# Altium schematic sheet LAN.SchDoc
size B
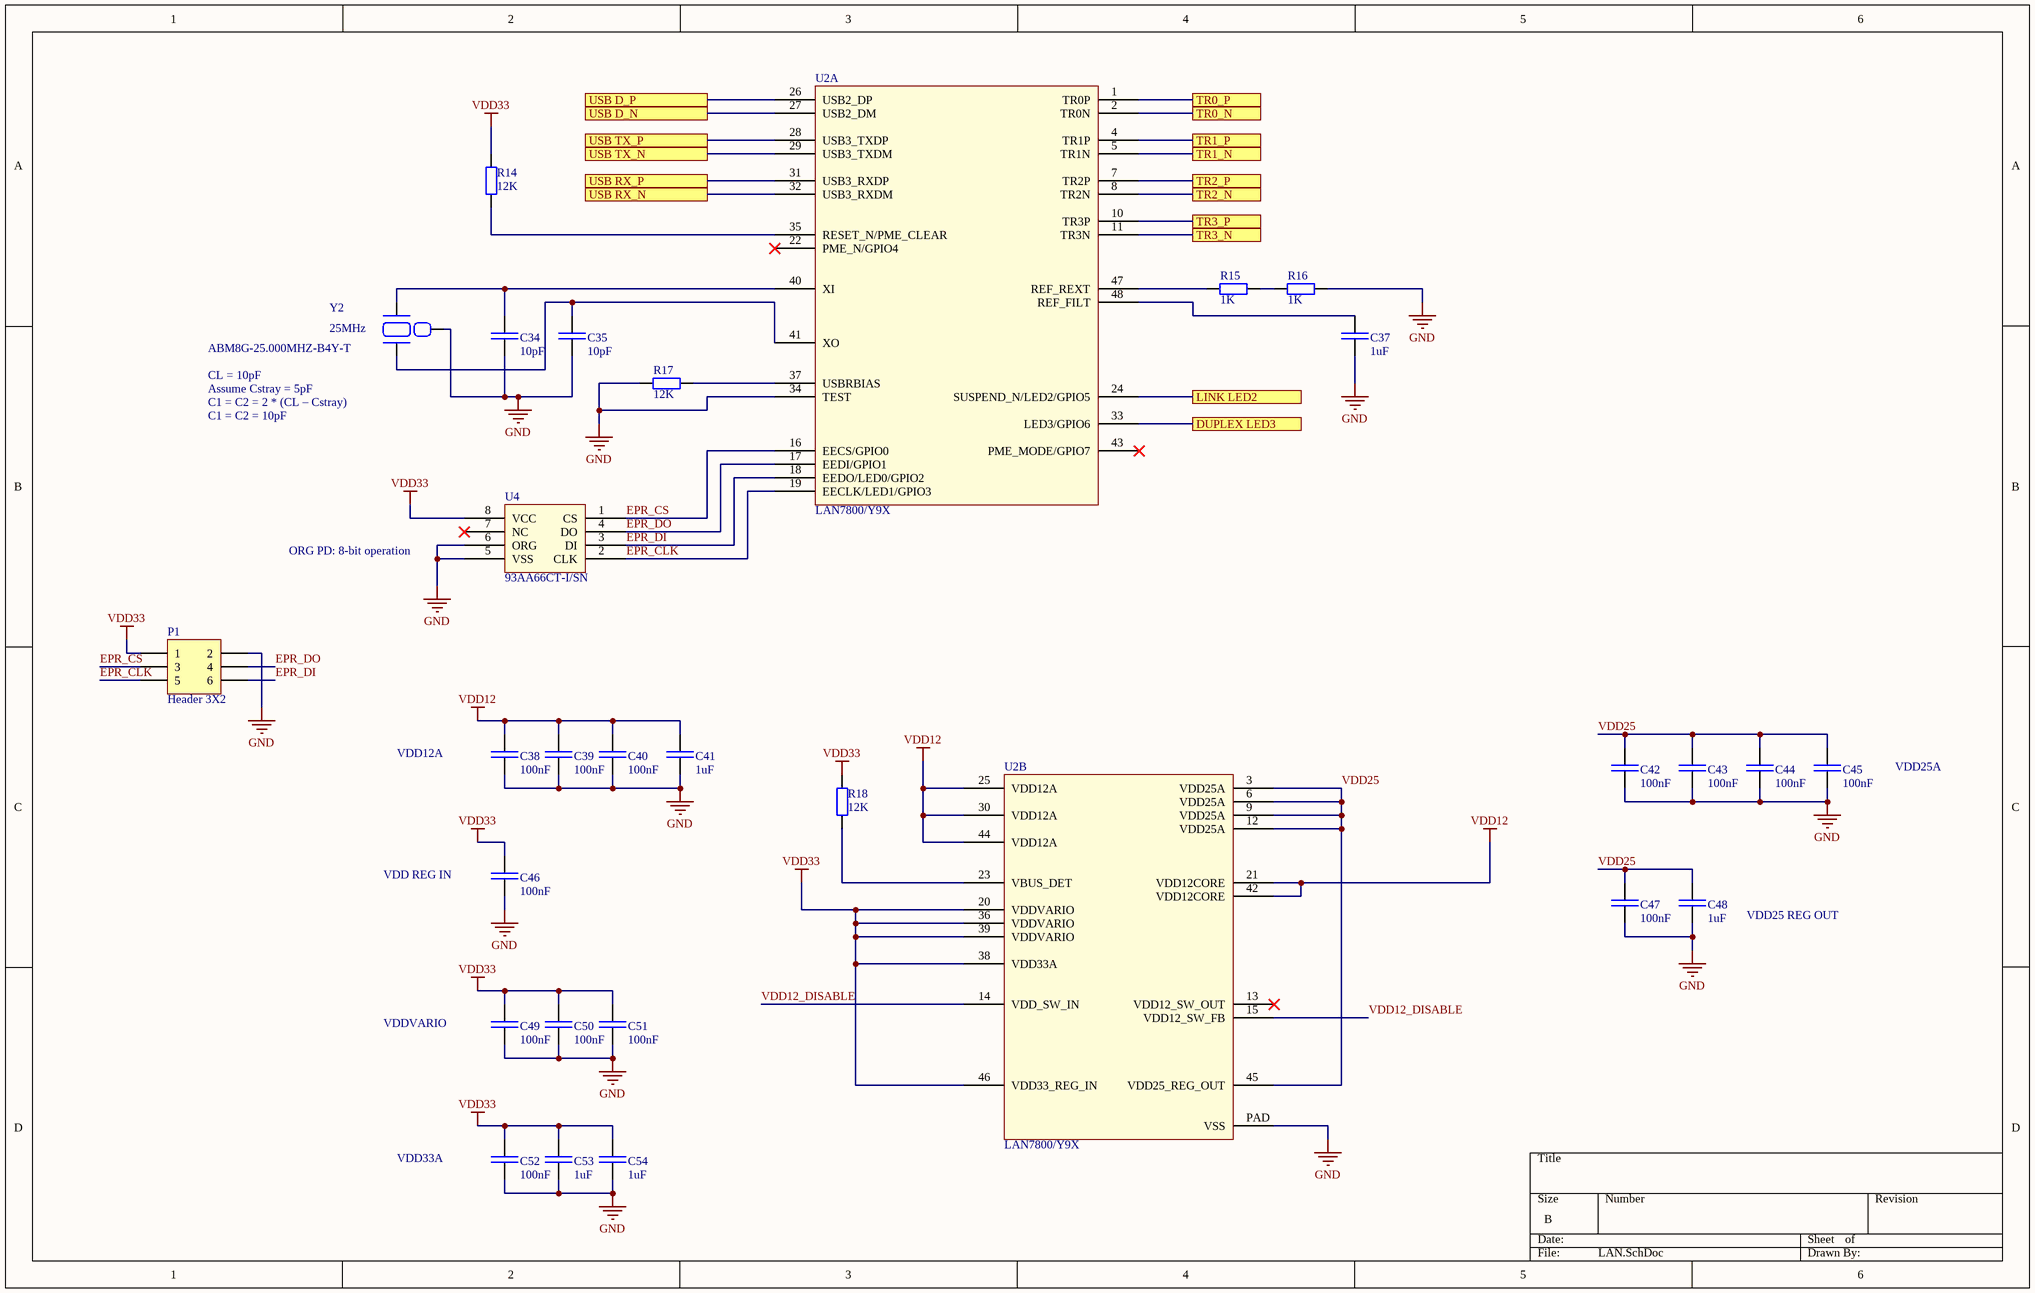
[diagram p0: LAN.SchDoc]

## Parts
C34  10pF  [CAP_SM0603_YAGEOCC2_N]
C35  10pF  [CAP_SM0603_YAGEOCC2_N]
C37  1uF  [CAP_SM0805_YAGEOCC2_N]
C38  100nF  [CAP_SM0603_YAGEOCC2_N]
C39  100nF  [CAP_SM0603_YAGEOCC2_N]
C40  100nF  [CAP_SM0603_YAGEOCC2_N]
C41  1uF  [CAP_SM0805_YAGEOCC2_N]
C42  100nF  [CAP_SM0603_YAGEOCC2_N]
C43  100nF  [CAP_SM0603_YAGEOCC2_N]
C44  100nF  [CAP_SM0603_YAGEOCC2_N]
C45  100nF  [CAP_SM0603_YAGEOCC2_N]
C46  100nF  [CAP_SM0603_YAGEOCC2_N]
C47  100nF  [CAP_SM0603_YAGEOCC2_N]
C48  1uF  [CAP_SM0805_YAGEOCC2_N]
C49  100nF  [CAP_SM0603_YAGEOCC2_N]
C50  100nF  [CAP_SM0603_YAGEOCC2_N]
C51  100nF  [CAP_SM0603_YAGEOCC2_N]
C52  100nF  [CAP_SM0603_YAGEOCC2_N]
C53  1uF  [CAP_SM0805_YAGEOCC2_N]
C54  1uF  [CAP_SM0805_YAGEOCC2_N]
P1  Header 3X2  [HDR2X3]
R14  12K  [RES_SM0603_YAGEORC_N]
R15  1K  [RES_SM0603_YAGEORC_N]
R16  1K  [RES_SM0603_YAGEORC_N]
R17  12K  [RES_SM0603_YAGEORC_N]
R18  12K  [RES_SM0603_YAGEORC_N]
U2  LAN7800/Y9X  [QFN50P700X700X100_HS-49N - LAN7800/Y9X]  (parts A,B of 2)
U4  93AA66CT-I/SN  [SOIC127P600X175-8N - 93AA66CT-I/SN]
Y2  ABM8G-25.000MHZ-B4Y-T  [ABM8G-25.000MHZ-B4Y-T]

## Ports
DUPLEX LED3, LINK LED2, TR0_N, TR0_P, TR1_N, TR1_P, TR2_N, TR2_P, TR3_N, TR3_P, USB D_N, USB D_P, USB RX_N, USB RX_P, USB TX_N, USB TX_P

## Nets
GND: C34.2 C35.2 C37.2 C38.2 C39.2 C40.2 C41.2 C42.2 C43.2 C44.2 C45.2 C46.2 C47.2 C48.2 C49.2 C50.2 C51.2 C52.2 C53.2 C54.2 P1.2 R16.2 R17.1 U2.34(TEST) U2.PAD(VSS) U4.5(VSS) U4.6(ORG) Y2.GND
VDD12: C38.1 C39.1 C40.1 C41.1 U2.21(VDD12CORE) U2.25(VDD12A) U2.30(VDD12A) U2.42(VDD12CORE) U2.44(VDD12A)
VDD33: C46.1 C49.1 C50.1 C51.1 C52.1 C53.1 C54.1 P1.1 R14.2 R18.2 U2.20(VDDVARIO) U2.36(VDDVARIO) U2.38(VDD33A) U2.39(VDDVARIO) U2.46(VDD33_REG_IN) U4.8(VCC)
DUPLEX LED3: U2.33(LED3/GPIO6) ; port DUPLEX LED3
EPR_CLK: P1.5 U2.19(EECLK/LED1/GPIO3) U4.2(CLK)
EPR_CS: P1.3 U2.16(EECS/GPIO0) U4.1(CS)
EPR_DI: P1.6 U2.18(EEDO/LED0/GPIO2) U4.3(DI)
EPR_DO: P1.4 U2.17(EEDI/GPIO1) U4.4(DO)
LINK LED2: U2.24(SUSPEND_N/LED2/GPIO5) ; port LINK LED2
TR0_N: U2.2(TR0N) ; port TR0_N
TR0_P: U2.1(TR0P) ; port TR0_P
TR1_N: U2.5(TR1N) ; port TR1_N
TR1_P: U2.4(TR1P) ; port TR1_P
TR2_N: U2.8(TR2N) ; port TR2_N
TR2_P: U2.7(TR2P) ; port TR2_P
TR3_N: U2.11(TR3N) ; port TR3_N
TR3_P: U2.10(TR3P) ; port TR3_P
USB D_N: U2.27(USB2_DM) ; port USB D_N
USB D_P: U2.26(USB2_DP) ; port USB D_P
USB RX_N: U2.32(USB3_RXDM) ; port USB RX_N
USB RX_P: U2.31(USB3_RXDP) ; port USB RX_P
USB TX_N: U2.29(USB3_TXDM) ; port USB TX_N
USB TX_P: U2.28(USB3_TXDP) ; port USB TX_P
VDD12_DISABLE: U2.14(VDD_SW_IN) U2.15(VDD12_SW_FB)
VDD25: C42.1 C43.1 C44.1 C45.1 C47.1 C48.1 U2.3(VDD25A) U2.6(VDD25A) U2.9(VDD25A) U2.12(VDD25A) U2.45(VDD25_REG_OUT)
NetC34_1: C34.1 U2.40(XI) Y2.1
NetC35_1: C35.1 U2.41(XO) Y2.3
NetC37_1: C37.1 U2.48(REF_FILT)
NetR14_1: R14.1 U2.35(RESET_N/PME_CLEAR)
NetR15_1: R15.1 U2.47(REF_REXT)
NetR15_2: R15.2 R16.1
NetR17_2: R17.2 U2.37(USBRBIAS)
NetR18_1: R18.1 U2.23(VBUS_DET)

Not connected (* = marked no-connect by the designer): U2 13(VDD12_SW_OUT)* 22(PME_N/GPIO4)* 43(PME_MODE/GPIO7)*; U4 7(NC)*

## Notes on the sheet
- C1 = C2 = 2 * (CL – Cstray)
- CL = 10pF
- Assume Cstray = 5pF
- C1 = C2 = 10pF
- ORG PD: 8-bit operation
- VDD12A
- VDD25A
- VDD REG IN
- VDD25 REG OUT
- VDDVARIO
- VDD33A
- (in symbol ABM8G-25.000MHZ-B4Y-T) 25MHz

## Library data of the parts
C34 C35 = CC0603JRNPO9BN100: CAP 10pF SM0603 NPO 50V YAGEO CC2; Tolerance (%): 5; Voltage Rating (Volts): 50; Category: Capacitor; Manufacturer: Yageo; Manufacturer Part Number: CC0603JRNPO9BN100; Package: 0603; Value: 10pF; Supplier Part Number 1: 721967; Supplier 1: Farnell; ComponentLink1URL: http://www.yageo.com; ComponentLink1Description: Manufacturer Website; Supplier 2: Digi-Key; Supplier Part Number 2: 311-1058-1-ND
C37 C41 C48 C53 C54 = CC0805KKX7R8BB105: CAP 1uF SM0805 X7R 25V YAGEO CC2; Tolerance (%): 10; Voltage Rating (Volts): 25; Category: Capacitor; Manufacturer: Yageo; Manufacturer Part Number: CC0805KKX7R8BB105; Package: 0805; Value: 1uF; Supplier Part Number 1: 1458903; Supplier 1: Farnell; ComponentLink1URL: http://www.yageo.com; ComponentLink1Description: Manufacturer Website; Supplier 2: Digi-Key; Supplier Part Number 2: 311-1456-1-ND
C38-C40 C42-C47 C49-C52 = CC0603KRX7R9BB104: CAP 100nF SM0603 X7R 50V YAGEO CC2; Tolerance (%): 10; Voltage Rating (Volts): 50; Category: Capacitor; Manufacturer: Yageo; Manufacturer Part Number: CC0603KRX7R9BB104; Package: 0603; Value: 100nF; Supplier Part Number 1: 1362556; Supplier 1: Farnell; ComponentLink1URL: http://www.yageo.com; ComponentLink1Description: Manufacturer Website; Supplier 2: Digi-Key; Supplier Part Number 2: 311-1344-1-ND
P1 = Header 3X2: Header, 3-Pin, Dual row; LatestRevisionDate: 17-Jul-2002; LatestRevisionNote: Re-released for DXP Platform.; Publisher: Altium Limited
R14 R17 R18 = RC0603FR-0712KL: RES 12K SM0603 YAGEO RC_L; Power (Watts): 0.1; Resistance (Ohms): 12000; Tolerance (%): 1; Category: Resistor; Manufacturer: Yageo; Manufacturer Part Number: RC0603FR-0712KL; Package: 0603; Value: 12K; Supplier Part Number 1: 9238611; Supplier 1: Farnell; ComponentLink1URL: http://www.yageo.com; ComponentLink1Description: Manufacturer Website; Supplier 2: Digi-Key; Supplier Part Number 2: 311-12.0KHRCT-ND
R15 R16 = RC0603FR-071KL: RES 1K SM0603 YAGEO RC_L; Power (Watts): 0.1; Resistance (Ohms): 1000; Tolerance (%): 1; Category: Resistor; Manufacturer: Yageo; Manufacturer Part Number: RC0603FR-071KL; Package: 0603; Value: 1K; Supplier Part Number 1: 9238484; Supplier 1: Farnell; ComponentLink1URL: http://www.yageo.com; ComponentLink1Description: Manufacturer Website; Supplier 2: Digi-Key; Supplier Part Number 2: 311-1.00KHRCT-ND
U2 = LAN7800/Y9X: IC ETHERNET CTLR USB 48SQFN 7x7
U4 = 93AA66CT-I/SN: IC EEPROM 4KBIT MICROWIRE 8SOIC
Y2 = ABM8G-25.000MHZ-B4Y-T: CRYSTAL 25.0000MHZ 10PF SMD